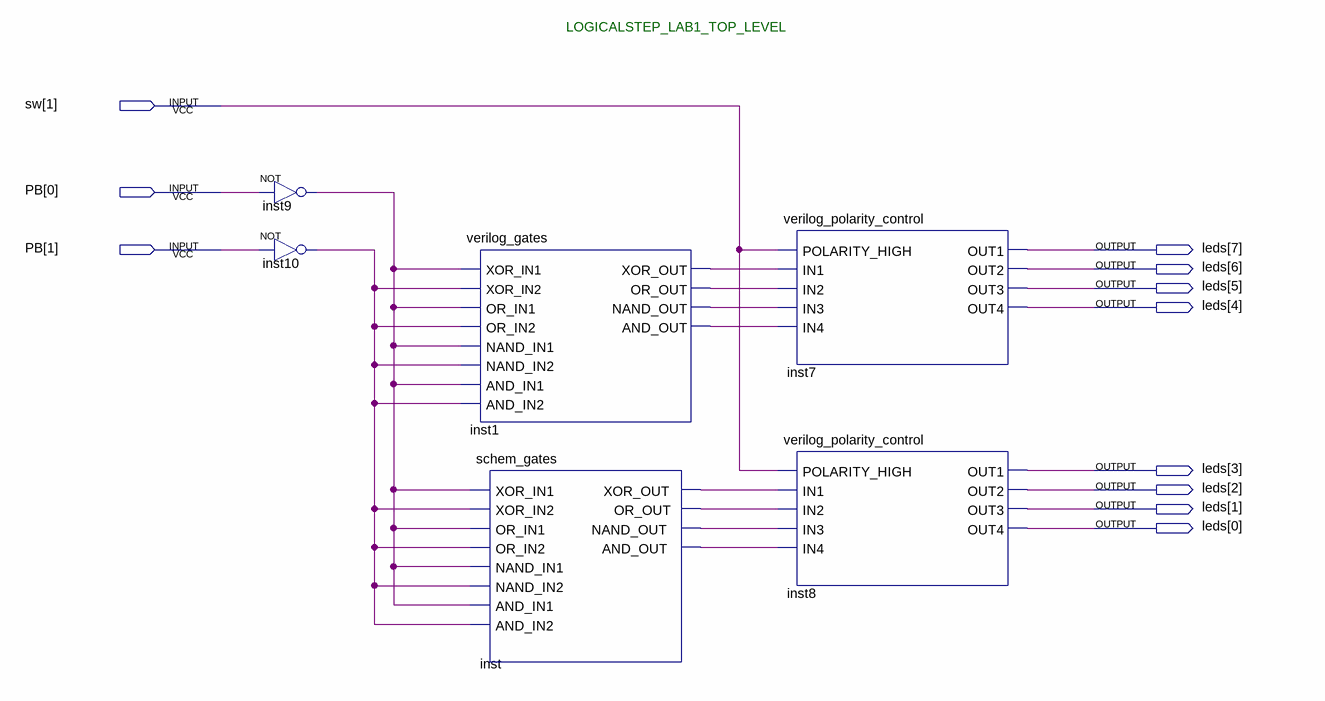
[diagram p0: schematic sheet]
// Quartus schematic LogicalStep_Lab1_top.bdf as structural Verilog: 6 symbols, 11 pins
module LogicalStep_Lab1_top (
  input  [1:1] sw,
  input  [1:0] PB,
  output [7:0] leds
);

  wire inst1_and_out, inst1_nand_out, inst1_or_out, inst1_xor_out, inst9_out, inst10_out, inst_and_out,
       inst_nand_out, inst_or_out, inst_xor_out;

  not inst9 (inst9_out, PB[0]);
  not inst10 (inst10_out, PB[1]);
  verilog_gates inst1 (
    .XOR_IN1(inst9_out), .XOR_IN2(inst10_out), .OR_IN1(inst9_out), .OR_IN2(inst10_out), .NAND_IN1(inst9_out),
    .NAND_IN2(inst10_out), .AND_IN1(inst9_out), .AND_IN2(inst10_out), .XOR_OUT(inst1_xor_out),
    .OR_OUT(inst1_or_out), .NAND_OUT(inst1_nand_out), .AND_OUT(inst1_and_out));
  schem_gates inst (
    .XOR_IN1(inst9_out), .XOR_IN2(inst10_out), .OR_IN1(inst9_out), .OR_IN2(inst10_out), .NAND_IN1(inst9_out),
    .NAND_IN2(inst10_out), .AND_IN1(inst9_out), .AND_IN2(inst10_out), .XOR_OUT(inst_xor_out),
    .OR_OUT(inst_or_out), .NAND_OUT(inst_nand_out), .AND_OUT(inst_and_out));
  verilog_polarity_control inst7 (
    .POLARITY_HIGH(sw[1]), .IN1(inst1_xor_out), .IN2(inst1_or_out), .IN3(inst1_nand_out),
    .IN4(inst1_and_out), .OUT1(leds[7]), .OUT2(leds[6]), .OUT3(leds[5]), .OUT4(leds[4]));
  verilog_polarity_control inst8 (
    .POLARITY_HIGH(sw[1]), .IN1(inst_xor_out), .IN2(inst_or_out), .IN3(inst_nand_out), .IN4(inst_and_out),
    .OUT1(leds[3]), .OUT2(leds[2]), .OUT3(leds[1]), .OUT4(leds[0]));

  // Notes on the sheet:
  //   LOGICALSTEP_LAB1_TOP_LEVEL
endmodule
